# EasyEDA schematic schematic.json
TITLE: Sheet_1; REV: 1.0; Date: 2026-10-05; Sheet: 1/1; Company: Your Company
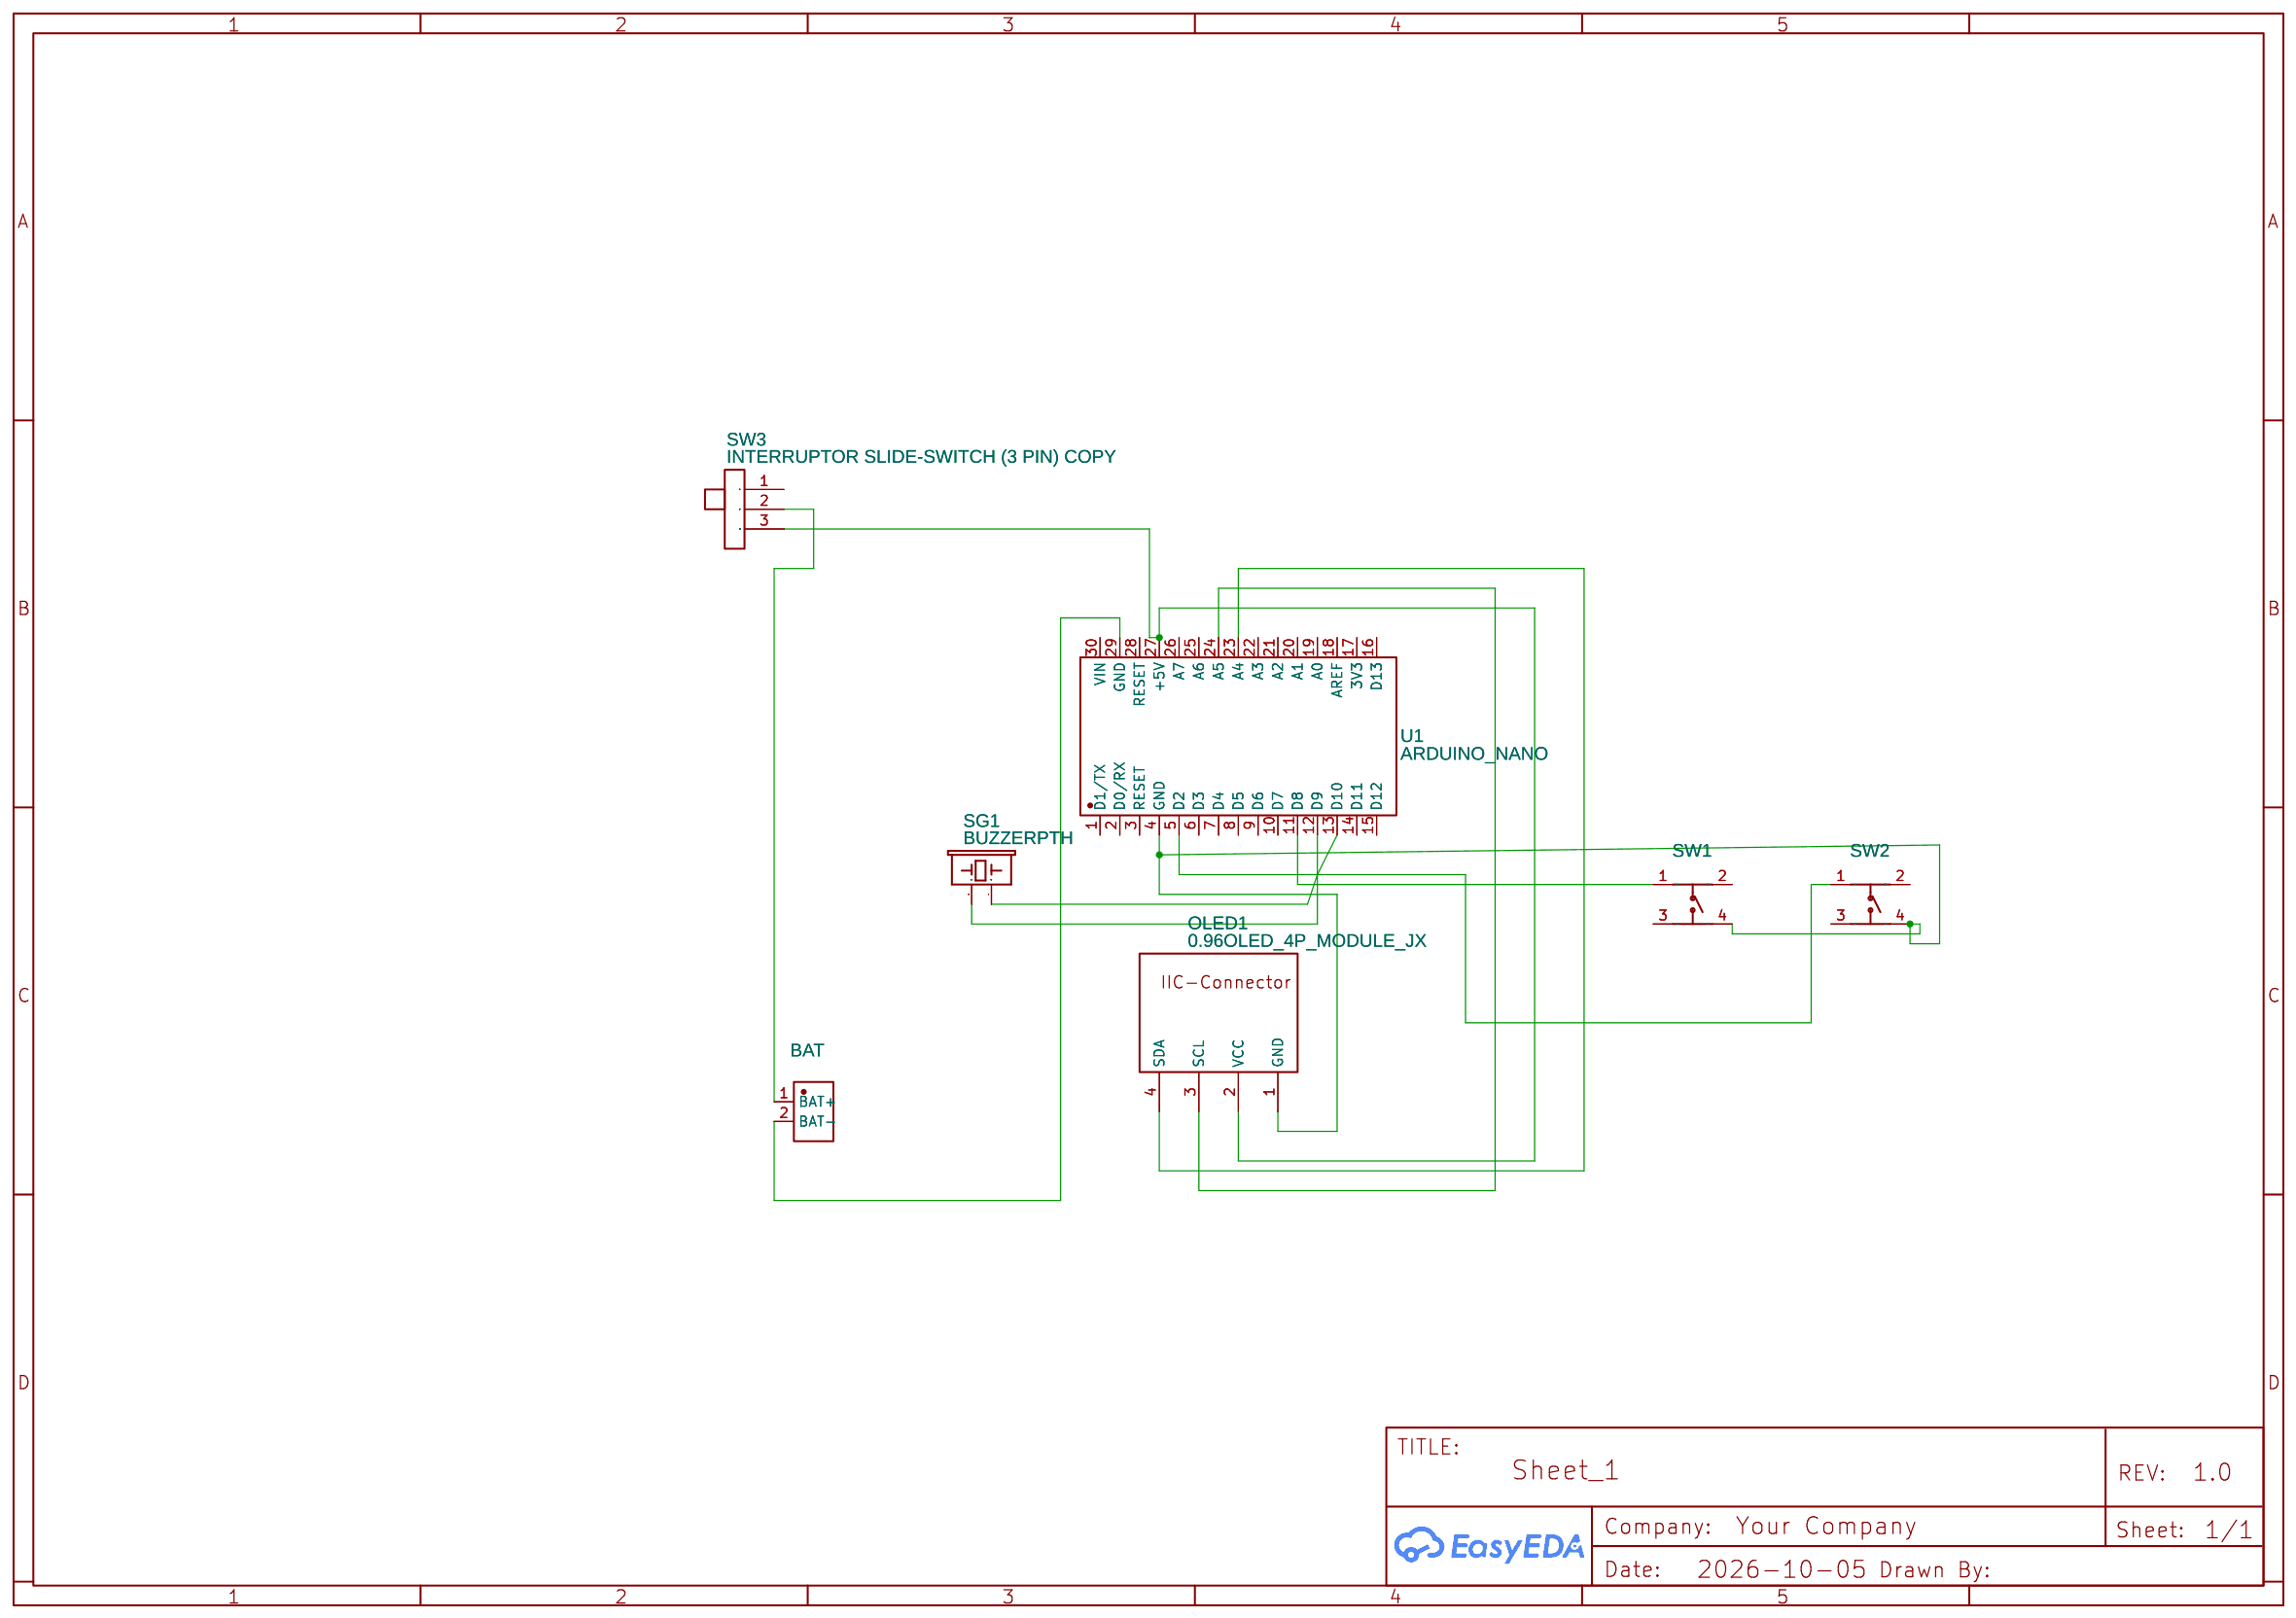
[diagram p0: schematic sheet]

## Parts
BAT  880-70-002-10-001101  [HDR-TH_2P-P2.00-V-M]
OLED1  0.96OLED_4P_MODULE_JX  [0.96OLED_4P]
SG1  BUZZERPTH  [BUZZER-12MM]
SW1  SW1  [SW-SMD_4P-L6.0-W6.0-P4.50-LS9.2]
SW2  SW2  [SW-SMD_4P-L6.0-W6.0-P4.50-LS9.2]
SW3  INTERRUPTOR SLIDE-SWITCH (3 PIN) COPY  [SW-SMD_MST-12D18G4-SPDT-SLIDE-SWITCH]
U1  ARDUINO_NANO  [COMM-TH_ARDUINO_NANO]

## Library data of the parts
BAT = 880-70-002-10-001101: Supplier: LCSC; Supplier Part: C7200794; Manufacturer: Preci-Dip; JLCPCB Part Class: Extended Part; Contributor: lcsc
OLED1 = 0.96OLED_4P_MODULE_JX: Contributor: LCSC; Supplier: LCSC; Supplier Part: C9900004566; Manufacturer: null; JLCPCB Part Class: Extended Part
SG1 = BUZZERPTH: Buzzer 12mm; Contributor: SparkFun
SW1 SW2 = BUTTONTACT-6X6MM: Contributor: LCSC; Supplier: LCSC; Supplier Part: C9900004221; Manufacturer Part: Buttontact-6x6mm; Manufacturer: null; JLCPCB Part Class: Extended Part
SW3 = INTERRUPTOR SLIDE-SWITCH (3 PIN) COPY: Manufacturer: A+A Technology Co.,Ltd; link: https://www.aliexpress.com/item/32964400942.html?spm=a2g0s.9042311.0.0.27424c4dc1ZKZt; Contributor: avijitkakati22
U1 = ARDUINO_NANO: Contributor: lcsc; Supplier: LCSC; Supplier Part: C9900017879; Manufacturer: null; JLCPCB Part Class: Extended Part

## Nets
Net-(BAT-1): BAT.1(BAT+) SW3.2
Net-(BAT-2): BAT.2(BAT-) U1.29(GND)
Net-(OLED1-1): OLED1.1(GND) SW1.4(D) SW2.4(D) U1.4(GND)
Net-(OLED1-2): OLED1.2(VCC) SW3.3 U1.27(+5V)
Net-(OLED1-3): OLED1.3(SCL) U1.24(A5)
Net-(OLED1-4): OLED1.4(SDA) U1.23(A4)
Net-(SG1-+): SG1.+(1) U1.12(D9)
Net-(SG1--): SG1.-(2) U1.13(D10)
Net-(SW1-1): SW1.1(A) U1.11(D8)
Net-(SW2-1): SW2.1(A) U1.5(D2)

Not connected (* = marked no-connect by the designer): SW1 2(B) 3(C); SW2 2(B) 3(C); SW3 1; U1 1(D1/TX) 2(D0/RX) 3(RESET) 6(D3) 7(D4) 8(D5) 9(D6) 10(D7) 14(D11) 15(D12) 16(D13) 17(3V3) 18(AREF) 19(A0) 20(A1) 21(A2) 22(A3) 25(A6) 26(A7) 28(RESET) 30(VIN)
